# EAGLE design ring_mod_simple (EAGLE 5.10)
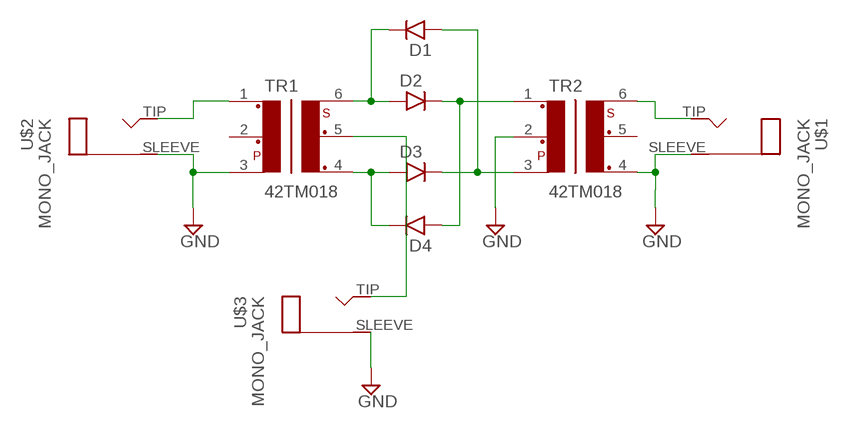
[diagram p0: schematic, sheet 1]

## Parts
D1  DO07  [DO07]
D2  DO07  [DO07]
D3  DO07  [DO07]
D4  DO07  [DO07]
TR1  42TM018  [42TM]
TR2  42TM018  [42TM]
U$1  MONO_JACK  [MONO_JACK]
U$2  MONO_JACK  [MONO_JACK]
U$3  MONO_JACK  [MONO_JACK]

## Nets
GND: TR1.3 TR2.2 TR2.4 U$1.SLEEVE U$2.SLEEVE U$3.SLEEVE
N$1: D1.C D2.A TR1.6
N$2: D2.C D4.A TR2.1
N$3: D3.A D4.C TR1.4
N$4: D1.A D3.C TR2.3
N$5: TR1.1 U$2.TIP
N$7: TR2.6 U$1.TIP
N$9: TR1.5 U$3.TIP
Unconnected: TR1.2 TR2.5

## Library data of the parts
D1-D4 = gm-diodes:DO07: DO-07 Package for 1N34A and similar Ge diodes
TR1 TR2 = trafo-xicon:42T?*: Xicon Micro-Mini EI-12 Audio Transformers 42TL/42TC/42TM Series Source: http://www.mouser.com//catalog/specsheets/164201.pdf http://www.mouser.com/catalog/specsheets/114225.pdf http://www.mouser.com/catalog/specsheets/164267.pdf
U$1-U$3 = 00_steve:MONO_JACK

## Board
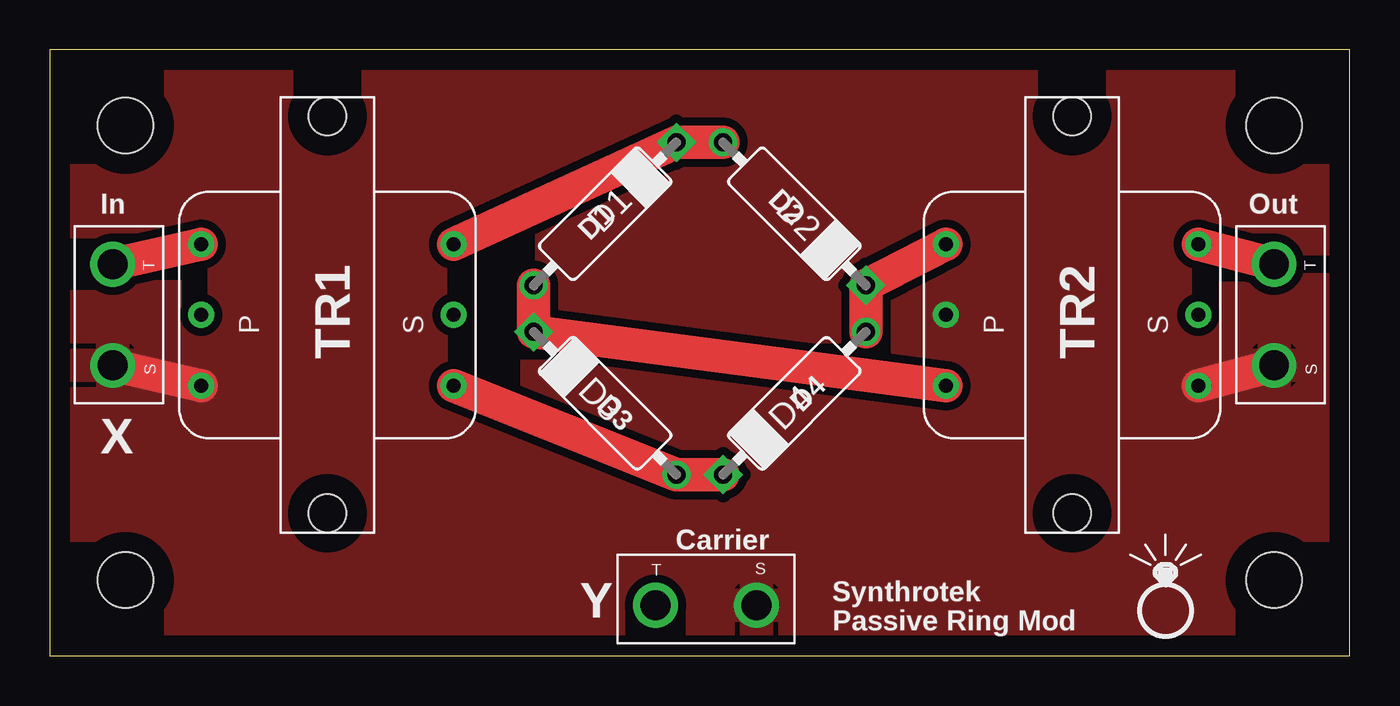
[diagram p1: board, top side]
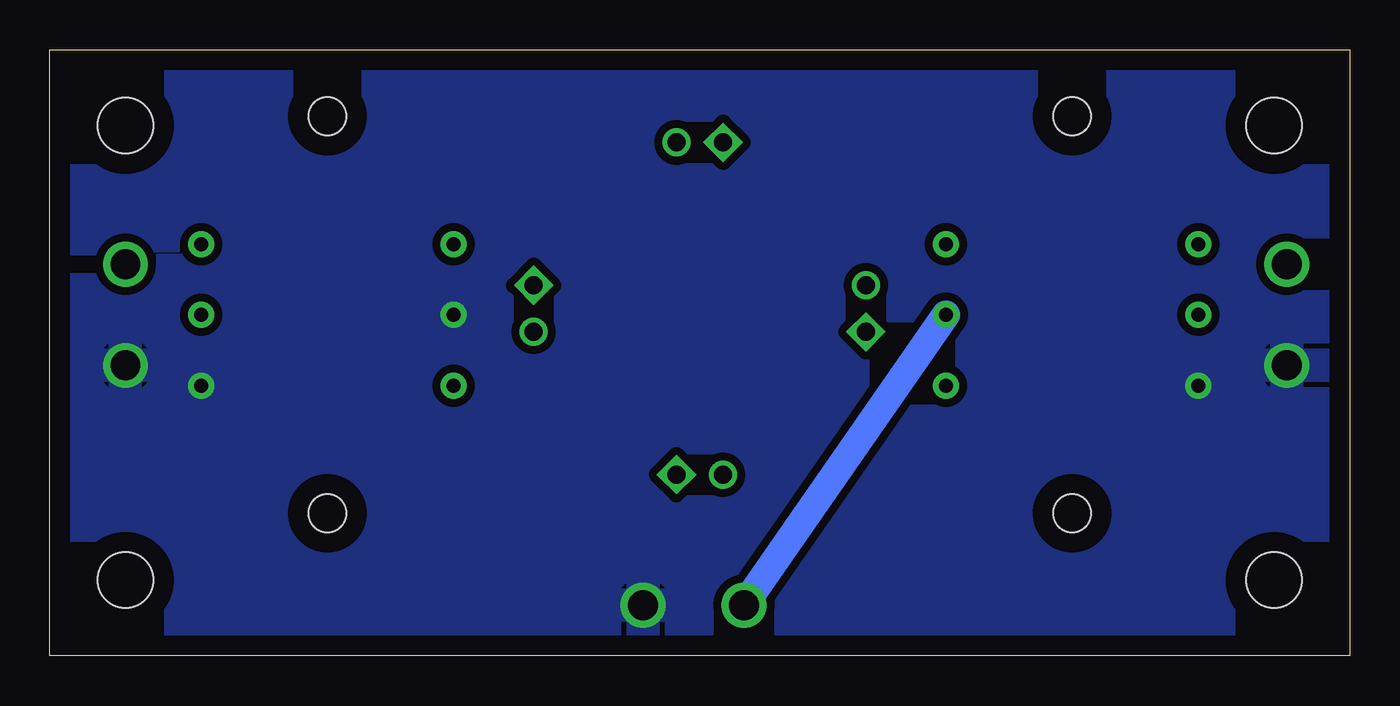
[diagram p2: board, bottom side, seen from below]

Size 65.41 x 30.48 mm. Coordinates in mm from the lower left corner, seen from the top.
Outline: 0,0 65.41,0 65.41,30.48 0,30.48 0,0
Copper layers (1*16): Top 0.035mm / dielectric 1.5mm / Bottom 0.035mm
Design rules "default": minimum track width 10mil, minimum drill 24mil, track to track 8mil, track to pad 8mil, pad to pad 8mil, via to via 8mil, smd to smd 8mil, copper to edge 40mil, drill to drill 8mil, minimum pad ring 10mil, minimum via ring 8mil, stop-mask expansion 4mil, vias tented up to drill 0mil, thermal gap 10mil
Holes 2.8 mm at 3.81,26.67 3.81,3.81 61.59,3.81 61.59,26.67

### Footprints (pad centres in the part's own frame; a part is rotated, then mirrored left to right if it is on the bottom)
DO07 = drill 0.9 round: A 5.08,0 | drill 0.9 square: C -5.08,0
42TM = drill 0.7 pad 1.3 round: 1 -3.556,-6.35; 2 0,-6.35; 3 3.556,-6.35; 4 3.556,6.35; 5 0,6.35; 6 -3.556,6.35 | hole 1.9: -9.982,0; 9.982,0
MONO_JACK = drill 1.5 round: SLEEVE 2.54,0; TIP -2.54,0

### Placement (x,y rotation side)
D1  27.94,22.23 225 top
D2  37.47,22.23 135 top
D3  27.94,12.7 315 top
D4  37.47,12.7 45 top
TR1  13.97,17.14 270 top
TR2  51.44,17.14 270 top
U$1  61.59,17.14 270 top
U$2  3.17,17.14 270 top
U$3  33.02,2.54 0 top

### Tracks (layer width: path | path; a pad name or v marks a point on that pad's centre or on a via)
GND
  Top 1.676: U$2.SLEEVE TR1.3 | TR2.4 U$1.SLEEVE
  pour Bottom (isolate 0.406): 0,30.48 65.41,30.48 65.41,0 0,0
  pour Top (isolate 0.406): 0,30.48 65.41,30.48 65.41,0 0,0
N$1
  Top 1.676: TR1.6 D1.C D2.A
N$2
  Top 1.676: TR2.1 D2.C D4.A
N$3
  Top 1.676: TR1.4 D3.A D4.C
N$4
  Top 1.676: D1.A D3.C TR2.3
N$5
  Top 1.676: U$2.TIP TR1.1
N$7
  Top 1.676: TR2.6 U$1.TIP
N$9
  Bottom 1.422: U$3.TIP TR1.5

### Text on the board
tPlace: D2 | In | Out | D1 | TR1 | TR2 | D3 | D4 | X | Carrier | Synthrotek | Y | Passive Ring Mod